# EAGLE design POTENCIOSTATO_22-11-2018 (EAGLE 9.2.2)
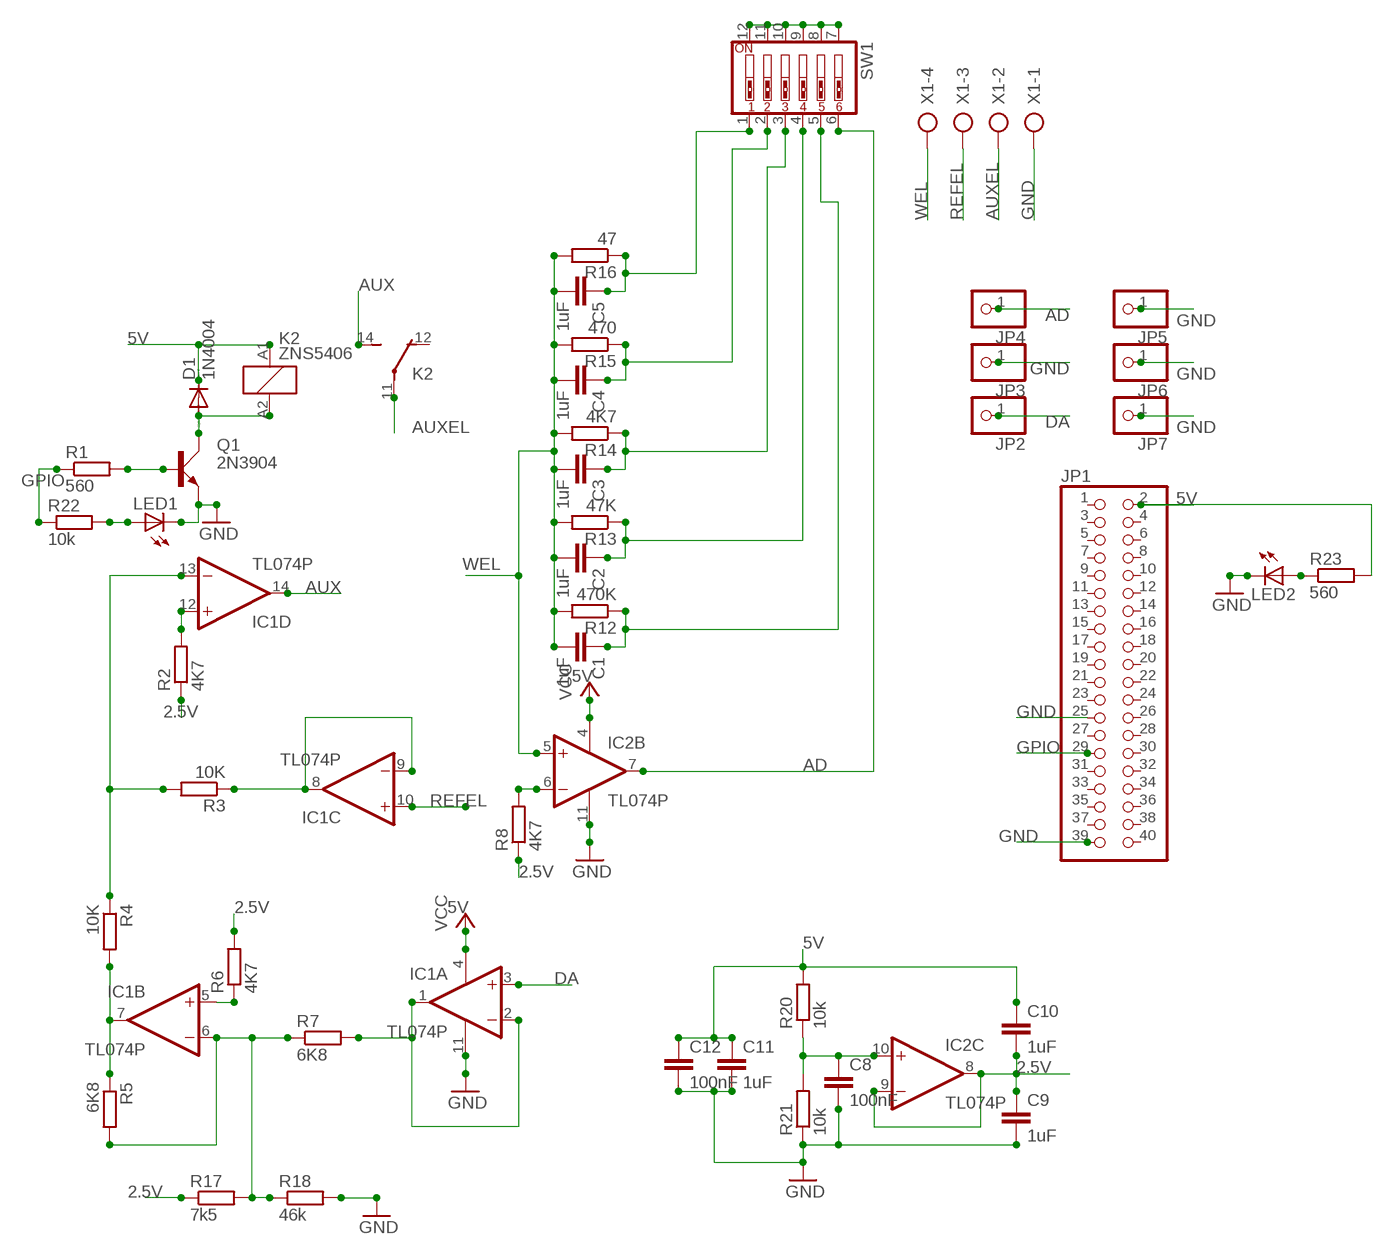
[diagram p0: schematic, sheet 1]

## Parts
C1  1uF  C-EUC0805  [C0805]
C2  1uF  C-EUC0805  [C0805]
C3  1uF  C-EUC0805  [C0805]
C4  1uF  C-EUC0805  [C0805]
C5  1uF  C-EUC0805  [C0805]
C8  100nF  C-EUC0805  [C0805]
C9  1uF  C-EUC0805  [C0805]
C10  1uF  C-EUC0805  [C0805]
C11  1uF  C-EUC0805  [C0805]
C12  100nF  C-EUC0805  [C0805]
D1  1N4004  [DO41-10]
IC1  TL074P  [DIL14]
IC2  TL074P  [DIL14]
JP1  PINHD-2X20/90  [2X20/90]
JP2  PINHD-1X1  [1X01]
JP3  PINHD-1X1  [1X01]
JP4  PINHD-1X1  [1X01]
JP5  PINHD-1X1  [1X01]
JP6  PINHD-1X1  [1X01]
JP7  PINHD-1X1  [1X01]
K2  ZNS5406  [ZN5]
LED1  LEDSML0805  [SML0805]
LED2  LEDSML0805  [SML0805]
Q1  2N3904  [TO92D]
R1  560  R-EU_R0805  [R0805]
R2  4K7  R-EU_R0805  [R0805]
R3  10K  R-EU_R0805  [R0805]
R4  10K  R-EU_R0805  [R0805]
R5  6K8  R-EU_R0805  [R0805]
R6  4K7  R-EU_R0805  [R0805]
R7  6K8  R-EU_R0805  [R0805]
R8  4K7  R-EU_R0805  [R0805]
R12  470K  R-EU_R0805  [R0805]
R13  47K  R-EU_R0805  [R0805]
R14  4K7  R-EU_R0805  [R0805]
R15  470  R-EU_R0805  [R0805]
R16  47  R-EU_R0805  [R0805]
R17  7k5  R-EU_R0805  [R0805]
R18  46k  R-EU_R0805  [R0805]
R20  10k  R-EU_R0805  [R0805]
R21  10k  R-EU_R0805  [R0805]
R22  10k  R-EU_R0805  [R0805]
R23  560  R-EU_R0805  [R0805]
SW1  SW_DIP-6  [EDG-06]
X1  AK500/4  [AK500/4]

## Nets
2.5V: C9.1 C10.2 IC2.8(C:OUT) IC2.9(C:-IN) R2.1 R6.2 R8.1 R17.1
5V: C10.1 C11.1 C12.1 D1.C IC1.4(P:V+) IC2.4(P:V+) JP1.2 K2.A1 R20.2 R23.2 ; supply symbol labelled VCC
AD: IC2.7(B:OUT) JP4.1 SW1.6
AUX: IC1.14(D:OUT) K2.14(2:S)
AUXEL: K2.11(2:P) X1.2
DA: IC1.3(A:+IN) JP2.1
GND: C8.2 C9.2 C11.2 C12.2 IC1.11(P:V-) IC2.11(P:V-) JP1.25 JP1.39 JP3.1 JP5.1 JP6.1 JP7.1 LED1.C LED2.C Q1.E R18.2 R21.1 X1.1
GPIO: JP1.29 R1.1 R22.1
N$1: C5.1 R16.1 SW1.1
N$2: C4.1 R15.1 SW1.2
N$3: C3.1 R14.1 SW1.3
N$4: C2.1 R13.1 SW1.4
N$5: C1.1 R12.1 SW1.5
N$6: IC2.6(B:-IN) R8.2
N$8: SW1.7 SW1.8 SW1.9 SW1.10 SW1.11 SW1.12
N$9: LED1.A R22.2
N$10: C8.1 IC2.10(C:+IN) R20.1 R21.2
N$12: D1.A K2.A2 Q1.C
N$13: IC1.12(D:+IN) R2.2
N$14: Q1.B R1.2
N$15: IC1.8(C:OUT) IC1.9(C:-IN) R3.1
N$16: IC1.13(D:-IN) R3.2 R4.1
N$17: IC1.7(B:OUT) R4.2 R5.1
N$18: IC1.6(B:-IN) R5.2 R7.1 R17.2 R18.1
N$19: IC1.1(A:OUT) IC1.2(A:-IN) R7.2
N$20: IC1.5(B:+IN) R6.1
N$21: LED2.A R23.1
REFEL: IC1.10(C:+IN) X1.3
WEL: C1.2 C2.2 C3.2 C4.2 C5.2 IC2.5(B:+IN) R12.2 R13.2 R14.2 R15.2 R16.2 X1.4
Unconnected: IC2.1(A:OUT) IC2.2(A:-IN) IC2.3(A:+IN) IC2.12(D:+IN) IC2.13(D:-IN) IC2.14(D:OUT) JP1.1 JP1.3 JP1.4 JP1.5 JP1.6 JP1.7 JP1.8 JP1.9 JP1.10 JP1.11 JP1.12 JP1.13 JP1.14 JP1.15 JP1.16 JP1.17 JP1.18 JP1.19 JP1.20 JP1.21 JP1.22 JP1.23 JP1.24 JP1.26 JP1.27 JP1.28 JP1.30 JP1.31 JP1.32 JP1.33 JP1.34 JP1.35 JP1.36 JP1.37 JP1.38 JP1.40 K2.12(2:O)

## Library data of the parts
C1-C5 C8-C12 = resistor:C-EU: CAPACITOR, European symbol
D1 = diode:1N4004: DIODE general purpose rectifier, 1 A
IC1 IC2 = linear:TL074: OP AMP
JP1 = pinhead:PINHD-2X20: PIN HEADER
JP2-JP7 = pinhead:PINHD-1X1: PIN HEADER
K2 = relay:ZNS5*: Miniature Power PCB Relay SCHRACK 1pole 10 A Source: http://www.schrack.com/.. 5847.pdf; OC_FARNELL: unknown; OC_NEWARK: unknown
LED1 LED2 = led:LED: LED OSRAM: - CHIPLED LG R971, LG N971, LY N971, LG Q971, LY Q971, LO R971, LY R971 LH N974, LH R974 LS Q976, LO Q976, LY Q976 LO Q996 - Hyper CHIPLED LW Q18S LB Q993, LB Q99A, LB R99A - SideLED LS A670, LO A670, LY A670, LG A670, LP A670 LB A673, LV A673, LT A673, LW A673 LH A674 LY A675 LS A676, LA A676, LO A676, LY A676, LW A676 LS A679, LY A679, LG A679 - Hyper Micro SIDELED® LS Y876, LA Y876, LO Y876, LY Y876 LT Y87S - SmartLED LW L88C, LW L88S LB L89C, LB L89S, LG L890 LS L89K, LO L89K, LY L89K LS L896, LA L896, LO L896, LY L896 - TOPLED LS T670, LO T670, LY T670, LG T670, LP T670 LSG T670, LSP T670, LSY T670, LOP T670, LYG T670 LG T671, LOG T671, LSG T671 LB T673, LV T673, LT T673, LW T673 LH T674 LS T676, LA T676, LO T676, LY T676, LB T676, LH T676, LSB T676, LW T676 LB T67C, LV T67C, LT T67C, LS T67K, LO T67K, LY T67K, LW E67C LS E67B, LA E67B, LO E67B, LY E67B, LB E67C, LV E67C, LT E67C LW T67C LS T679, LY T679, LG T679 LS T770, LO T770, LY T770, LG T770, LP T770 LB T773, LV T773, LT T773, LW T773 LH T774 LS E675, LA E675, LY E675, LS T675 LS T776, LA T776, LO T776, LY T776, LB T776 LHGB T686 LT T68C, LB T68C - Hyper Mini TOPLED® LB M676 - Mini TOPLED Santana® LG M470 LS M47K, LO M47K, LY M47K Source: http://www.osram.convergy.de LUXEON: - LUMILED® LXK2-PW12-R00, LXK2-PW12-S00, LXK2-PW14-U00, LXK2-PW14-V00 LXK2-PM12-R00, LXK2-PM12-S00, LXK2-PM14-U00 LXK2-PE12-Q00, LXK2-PE12-R00, LXK2-PE12-S00, LXK2-PE14-T00, LXK2-PE14-U00 LXK2-PB12-K00, LXK2-PB12-L00, LXK2-PB12-M00, LXK2-PB14-N00, LXK2-PB14-P00, LXK2-PB14-Q00 LXK2-PR12-L00, LXK2-PR12-M00, LXK2-PR14-Q00, LXK2-PR14-R00 LXK2-PD12-Q00, LXK2-PD12-R00, LXK2-PD12-S00 LXK2-PH12-R00, LXK2-PH12-S00 LXK2-PL12-P00, LXK2-PL12-Q00, LXK2-PL12-R00 Source: www.luxeon.com KINGBRIGHT: KA-3528ASYC Source: www.kingbright.com
Q1 = transistor-small-signal:2N3904: NPN TRANSISTOR
R1-R8 R12-R18 R20-R23 = resistor:R-EU_: RESISTOR, European symbol
SW1 = special:SW_DIP-6: DIP SWITCH
X1 = con-ptr500:AK500/4: CONNECTOR; OC_FARNELL: unknown; OC_NEWARK: unknown

## Board
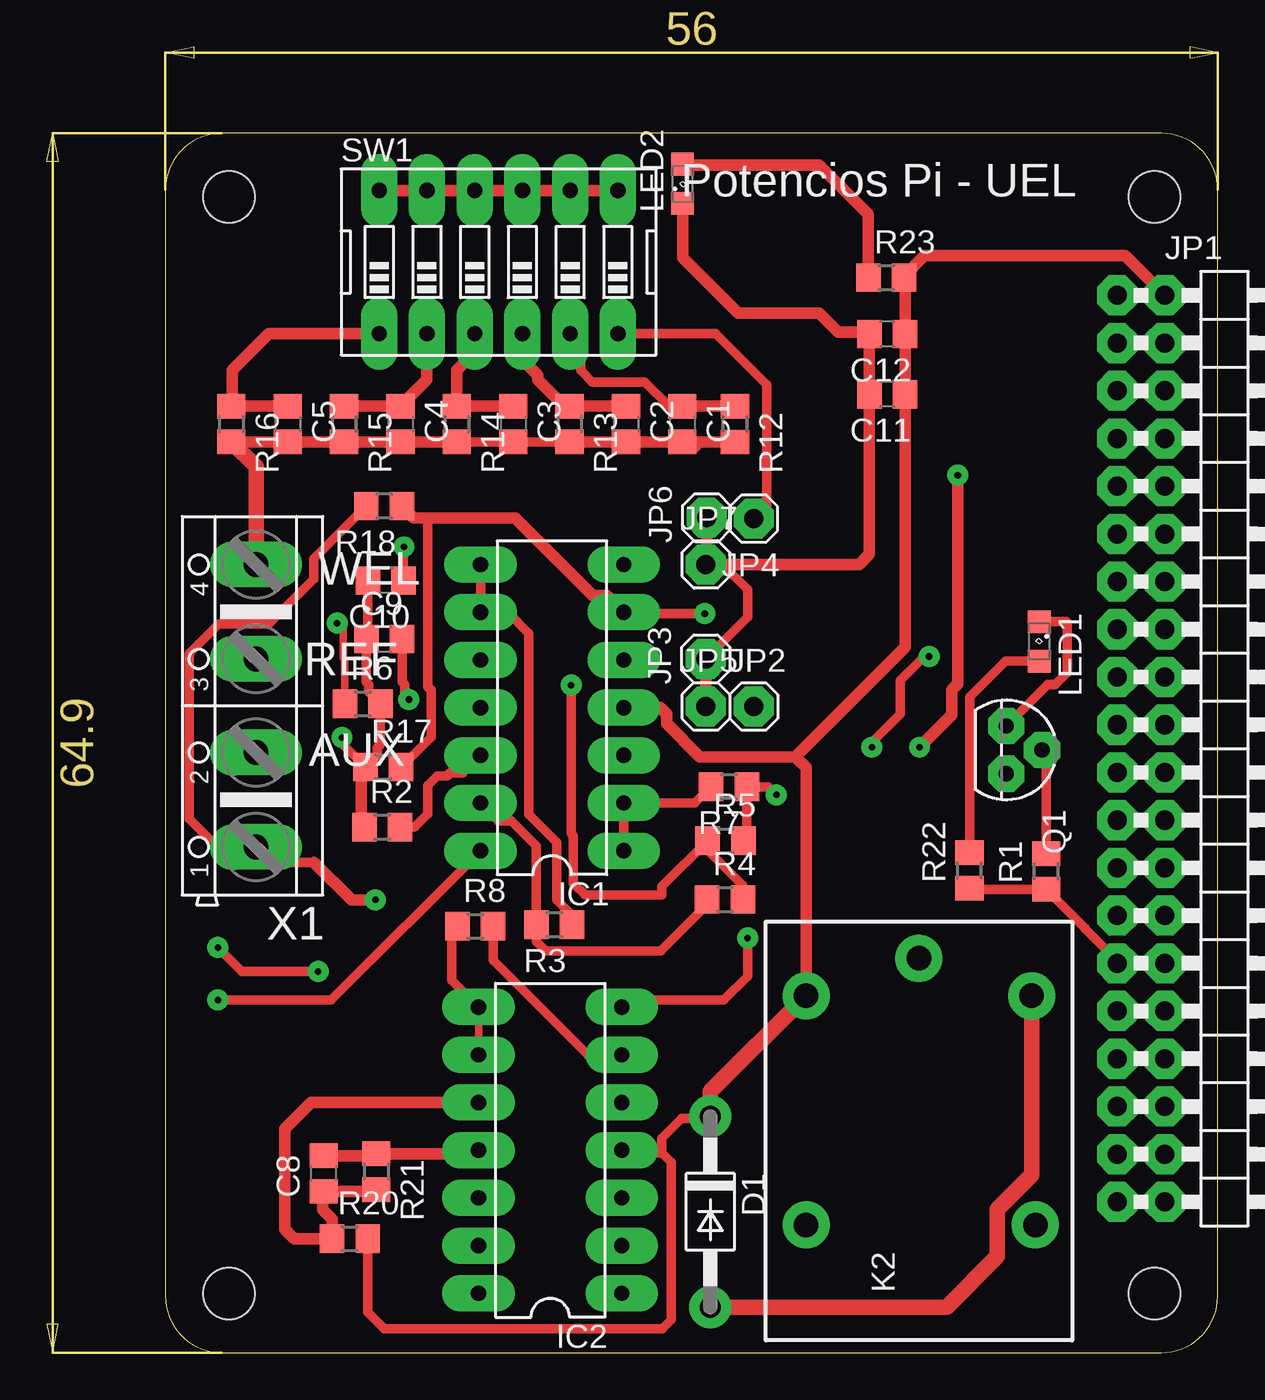
[diagram p1: board, top side]
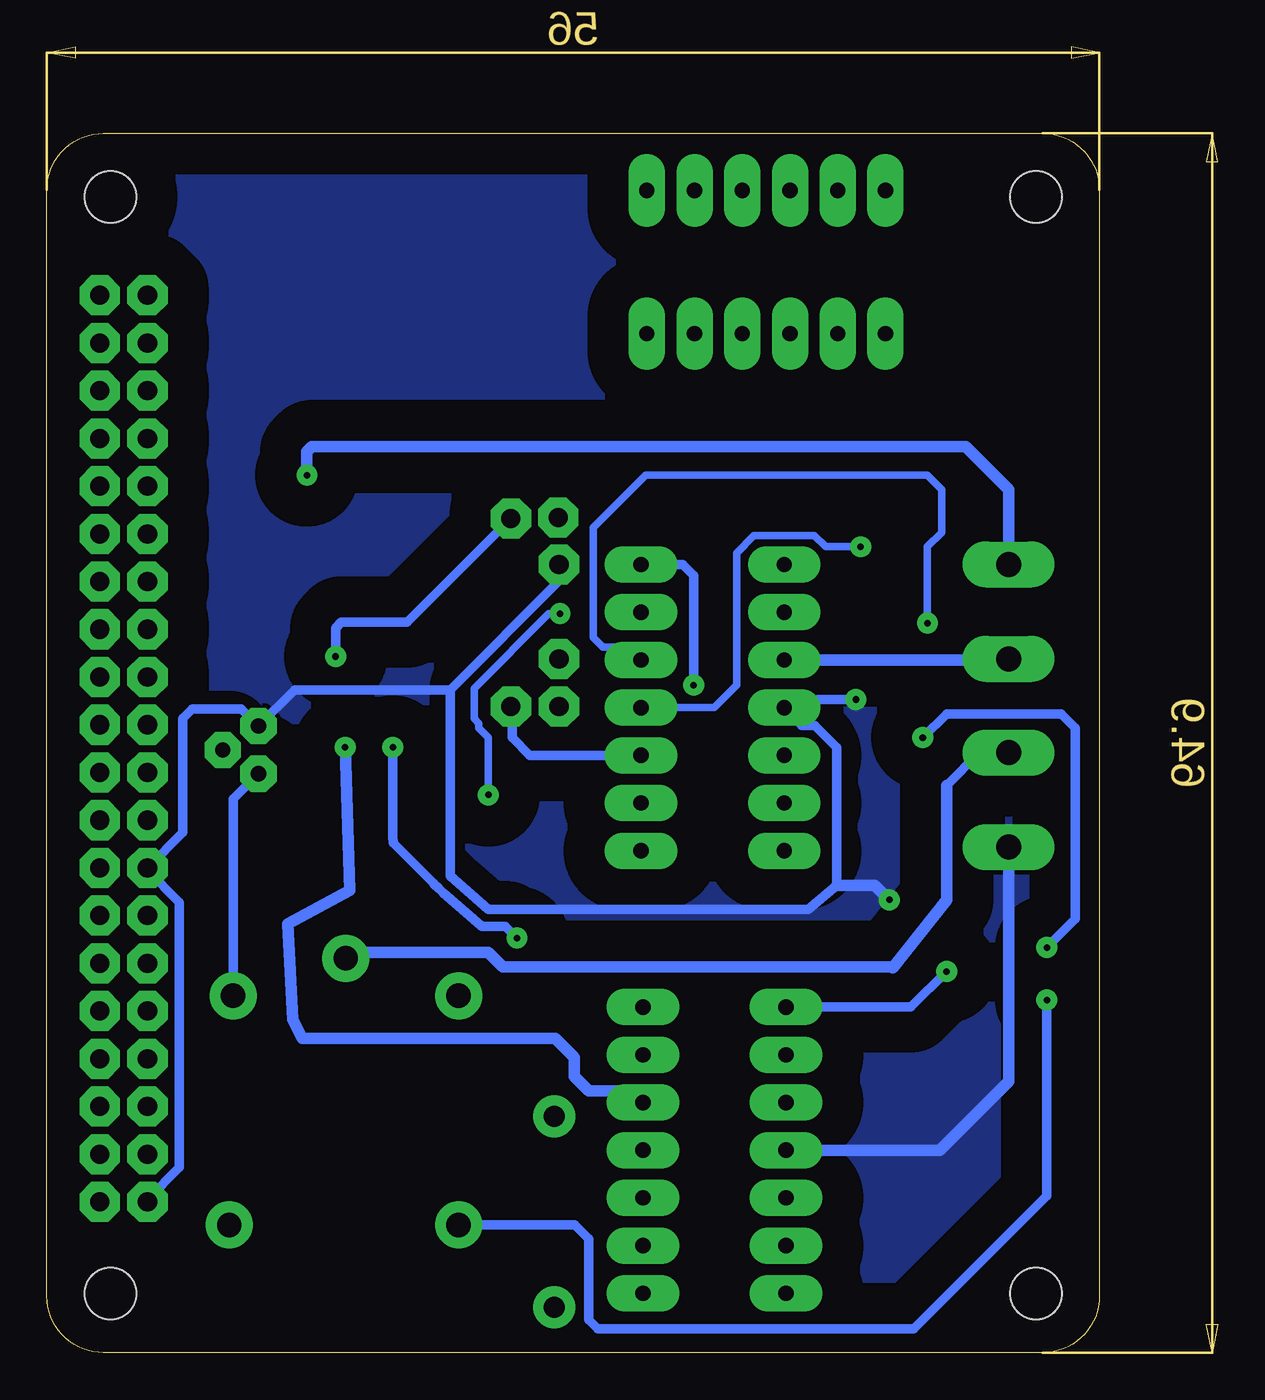
[diagram p2: board, bottom side, seen from below]

Size 56 x 64.9 mm. Coordinates in mm from the lower left corner, seen from the top.
Outline: 0,61.9 0,3 arc90 3,0 53,0 arc90 56,3 56,61.9 arc90 53,64.9 3,64.9 arc90 0,61.9
Copper layers (1*16): Top 0.035mm / dielectric 1.5mm / Bottom 0.035mm
Design rules "default *": minimum track width 12mil, minimum drill 0.35mm, track to track 15mil, track to pad 15mil, pad to pad 10mil, via to via 10mil, smd to smd 10mil, copper to edge 40mil, drill to drill 20mil, minimum pad ring 22mil, minimum via ring 15mil, stop-mask expansion 4mil, vias tented up to drill 0mil, thermal gap 10mil
Holes 2.75 mm at 52.62,61.52 3.38,61.52 3.38,3.15 52.62,3.15

### Footprints (pad centres in the part's own frame; a part is rotated, then mirrored left to right if it is on the bottom)
C0805 = smd 1.3 x 1.5: 1 -0.95,0; 2 0.95,0
DO41-10 = drill 1.118: A 5.08,0; C -5.08,0
DIL14 = drill 0.813 long: 1 -7.62,-3.81; 2 -5.08,-3.81; 3 -2.54,-3.81; 4 0,-3.81; 5 2.54,-3.81; 6 5.08,-3.81; 7 7.62,-3.81; 8 7.62,3.81; 9 5.08,3.81; 10 2.54,3.81; 11 0,3.81; 12 -2.54,3.81; 13 -5.08,3.81; 14 -7.62,3.81
2X20/90 = drill 1.016 octagon: 1 -24.13,-6.35; 2 -24.13,-3.81; 3 -21.59,-6.35; 4 -21.59,-3.81; 5 -19.05,-6.35; 6 -19.05,-3.81; 7 -16.51,-6.35; 8 -16.51,-3.81; 9 -13.97,-6.35; 10 -13.97,-3.81; 11 -11.43,-6.35; 12 -11.43,-3.81; 13 -8.89,-6.35; 14 -8.89,-3.81; 15 -6.35,-6.35; 16 -6.35,-3.81; 17 -3.81,-6.35; 18 -3.81,-3.81; 19 -1.27,-6.35; 20 -1.27,-3.81; 21 1.27,-6.35; 22 1.27,-3.81; 23 3.81,-6.35; 24 3.81,-3.81; 25 6.35,-6.35; 26 6.35,-3.81; 27 8.89,-6.35; 28 8.89,-3.81; 29 11.43,-6.35; 30 11.43,-3.81; 31 13.97,-6.35; 32 13.97,-3.81; 33 16.51,-6.35; 34 16.51,-3.81; 35 19.05,-6.35; 36 19.05,-3.81; 37 21.59,-6.35; 38 21.59,-3.81; 39 24.13,-6.35; 40 24.13,-3.81
1X01 = drill 1.016 octagon: 1 0,0
ZN5 = drill 1.3 pad 2.5: 11 8.89,0; 12 -5.31,-6.2; 14 -5.31,6; A1 6.89,6; A2 6.89,-6
SML0805 = smd 1.2 x 1.2: A 1.05,0; C -1.05,0
TO92D = drill 0.813 octagon: B 0,1.905; C 1.27,0; E -1.27,0
R0805 = smd 1.3 x 1.5: 1 -0.95,0; 2 0.95,0
EDG-06 = drill 0.813 long: 1 -6.35,-3.81; 2 -3.81,-3.81; 3 -1.27,-3.81; 4 1.27,-3.81; 5 3.81,-3.81; 6 6.35,-3.81; 7 6.35,3.81; 8 3.81,3.81; 9 1.27,3.81; 10 -1.27,3.81; 11 -3.81,3.81; 12 -6.35,3.81
AK500/4 = drill 1.321 long: 1 -7.518,0; 2 -2.489,0; 3 2.489,0; 4 7.518,0

### Placement (x,y rotation side)
C1  27.51,49.42 270 top
C2  24.51,49.42 270 top
C3  18.51,49.42 270 top
C4  12.51,49.42 270 top
C5  6.51,49.42 270 top
C8  8.44,9.53 90 top
C9  11.65,37.98 0 top
C10  11.72,41.09 180 top
C11  38.41,51.01 180 top
C12  38.41,54.21 180 top
D1  29,7.5 270 top
IC1  20.58,34.33 90 top
IC2  20.48,10.77 90 top
JP1  57,32.15 270 top
JP2  31.31,34.39 0 top
JP3  28.75,36.93 90 top
JP4  31.31,44.4 180 top
JP5  28.75,34.39 0 top
JP6  28.8,44.45 90 top
JP7  28.75,41.96 0 top
K2  40.1,12.1 90 top
LED1  46.5,37.86 270 top
LED2  27.52,62.21 90 top
Q1  44.75,32.08 270 top
R1  46.87,25.62 90 top
R2  11.54,27.97 0 top
R3  20.69,22.77 180 top
R4  29.78,24.12 0 top
R5  29.81,27.24 0 top
R6  10.5,34.54 0 top
R7  29.99,30.12 180 top
R8  16.5,22.7 0 top
R12  30.31,49.42 270 top
R13  21.51,49.42 270 top
R14  15.51,49.42 270 top
R15  9.51,49.42 270 top
R16  3.51,49.42 270 top
R17  11.6,31.18 0 top
R18  11.64,45.06 180 top
R20  9.82,6.06 0 top
R21  11.23,9.63 270 top
R22  42.79,25.66 90 top
R23  38.36,57.23 0 top
SW1  17.73,58.05 0 top
X1  4.83,34.43 90 top

### Tracks (layer width: path | path; a pad name or v marks a point on that pad's centre or on a via)
2.5V  (via drill 0.35)
  Top 0.406: IC2.8 IC2.9
  Top 0.508: C10.2 10.77,38.05 C9.1 10.7,35.69 10.83,35.55 10.83,35.15 R6.2 11.45,32.37 11.27,32.19 11.27,31.79 R17.1 9.4,32.43 v9.4,32.73 | R8.1 15.24,22.39 15.24,19.82 IC2.8 | v2.79,21.56 4.06,20.29 v8.13,20.29
  Top 0.61: R2.1 10.59,28.49 10.41,28.67 10.41,30.94 R17.1
  Bottom 0.508: v9.4,32.73 8.13,34 2.03,34 1.27,33.24 1.27,23.08 v2.79,21.56 | v8.13,20.29 10.02,18.39 IC2.8
5V  (via drill 0.35)
  Top 0.406: C10.1 12.7,41.12 v12.7,42.89
  Top 0.508: R20.2 10.77,2.15 11.65,1.27 26.45,1.27 26.92,1.74 26.92,10.13 26.42,10.63 | 24.68,10.38 IC2.4 24.43,10.63 26.42,10.63 | D1.C 29,12.46 27.48,12.46 26.42,11.4 26.42,10.63
  Top 0.61: JP1.2 51.08,58.39 40.39,58.39 39.31,57.31 R23.2 39.36,57.18 C12.1 C11.1 39.36,37.55 33.53,31.72 | 33.53,31.72 28.45,31.72 26.67,33.49 26.67,34 26.34,34.33 IC1.4 | 33.53,31.72 34.1,31.14 K2.A1
  Top 0.813: K2.A1 29,13.89 29,12.46
  Bottom 0.406: v12.7,42.89 14.56,42.89 15.16,43.5 18.38,43.5 19.3,42.57 19.3,35.53 20.5,34.33 IC1.4
AD  (via drill 0.35)
  Top 0.508: SW1.6 29.29,54.24 32,51.53 32,45.09 JP4.1 | IC2.7 24.66,18.76 29.72,18.76 30.99,20.03 v30.99,22.06 | v37.59,32.22 37.59,32.48 39.12,34 39.12,35.78 40.39,37.05 v40.64,37.05
  Bottom 0.508: JP4.1 36.83,38.88 40.34,38.88 40.64,38.57 v40.64,37.05 | v30.99,22.06 31.6,22.68 32.85,22.68 32.88,22.7 34.91,24.48 35.15,24.72 35.41,24.94 35.41,24.97 37.57,27.13 37.59,27.47 v37.59,32.22
AUX  (via drill 0.35)
  Top 0.508: v2.79,18.76 8.82,18.76 IC1.14
  Bottom 0.508: K2.14 27.91,6.79 27.18,6.06 27.18,1.74 26.7,1.27 9.87,1.27 2.79,8.35 v2.79,18.76
AUXEL
  Bottom 0.508: 8.13,30.19 6.38,31.94 X1.2
  Bottom 0.61: 8.13,30.19 8.13,24.1 10.98,20.48 11.04,20.54 31.75,20.54 32.51,21.3 39.79,21.3 K2.11
DA
  Bottom 0.508: JP2.1 31.24,34.32 31.24,32.73 30.3,31.79 IC1.3
GND  (via drill 0.35)
  Top 0.508: 16.48,10.58 IC2.11 | R18.2 7.9,42.27 7.9,41.18 5.49,38.77 2.84,38.77 1.75,37.69 1.27,37.2 1.27,28.41 2.77,26.91 X1.1 5.63,26.1 7.9,26.1 | LED1.C 47.93,38.91 48.01,38.83 48.01,36.21 47.37,35.57 46.97,35.57 Q1.E | C9.2 12.6,35.69 12.73,35.55 12.73,34.98 v12.95,34.76 | JP3.1 30.99,39.16 30.99,40.61 29.59,42.01 28.8,42.01
  Top 0.61: LED2.C 27.52,58.3 30.48,55.34 34.8,55.34 35.81,54.32 37.35,54.32 C12.2 C11.2 37.46,42.51 36.91,41.96 JP7.1 28.8,42.01 JP6.1 | JP5.1 JP3.1 | 7.9,26.1 9.91,24.1 v11.18,24.1 | C8.2 11.13,10.48 R21.1 16.48,10.58
  Bottom 0.508: 34.54,35.27 34.54,25.37 32.51,23.59 15.49,23.59 13.97,24.86 13.97,32.22 15.14,33.39 15.83,33.39 IC1.11 16.59,34.51 15.24,34.51 14.99,34.76 v12.95,34.76 | JP7.1 28.75,41.06 34.54,35.27 | 34.54,35.27 42.83,35.27 Q1.E 45.65,34.26 48.26,34.26 48.77,33.75 48.77,27.68 JP1.25 50.65,25.67 48.95,23.96 48.95,9.85 50.65,8.15 JP1.39
  Bottom 0.61: X1.1 4.83,14.44 8.5,10.77 IC2.11 | v11.18,24.1 11.94,24.86 13.97,24.86
  pour Bottom (isolate 2.184): 3.18,65.02 53.18,65.28 arc-90 56.2,62.28 56.2,2.9 arc-90 53.2,-0.1 3.2,-0.1 arc-90 0.2,2.9 0.2,62.02 arc-90
GPIO
  Top 0.508: JP1.29 50.65,20.85 48.95,22.55 48.95,22.59 R1.1 42.84,24.67 R22.1
N$1
  Top 0.61: C5.1 R16.1 3.56,50.42 3.56,52.29 5.51,54.24 SW1.1
N$2
  Top 0.61: R15.1 C4.1 13.92,51.79 SW1.2
N$3
  Top 0.61: C3.1 R14.1 15.51,52.3 16.51,53.31 16.51,54.19 SW1.3
N$4
  Top 0.61: C2.1 R13.1 21.22,50.37 19.81,51.78 19.81,52.04 19.05,52.8 19.05,54.19 SW1.4
N$5
  Top 0.508: SW1.5 22.1,53.68 22.1,52.29 22.73,51.66 25.52,51.66 26.81,50.37 C1.1
  Top 0.61: C1.1 R12.1
N$6
  Top 0.508: R8.2 17.45,20.87 22.47,15.85 IC2.6
N$8
  Top 0.61: SW1.12 SW1.11 SW1.10 SW1.9 SW1.8 SW1.7
N$9
  Top 0.508: R22.2 42.79,34.88 44.71,36.81 LED1.A
N$10
  Top 0.61: IC2.10 7.76,13.31 6.35,11.9 6.35,6.57 6.86,6.06 R20.1 8.87,7.1 8.38,7.59 8.38,8.53 C8.1 11.13,8.58 R21.2
N$12
  Top 0.813: D1.A 41.57,2.42 44.26,5.11 44.26,7.63 46.1,9.47 K2.A2
  Bottom 0.508: K2.A2 46.1,29.46 Q1.C
N$13
  Top 0.508: IC1.12 15.83,30.85 15.14,30.85 14.99,30.7 14.48,30.7 13.97,30.19 13.97,28.67 13.27,27.97 R2.2
N$14
  Top 0.508: R1.2 46.87,31.86 Q1.B
N$15
  Top 0.508: IC1.8 IC1.9 18.21,39.41 19.34,38.29 19.34,28.64 20.83,27.14 20.83,24.1 21.64,23.28 R3.1
N$16
  Top 0.508: IC1.13 17.71,28.31 18.4,28.31 19.74,26.96 R3.2 19.74,21.88 20.23,21.39 26.35,21.39 28.83,23.87 R4.1
N$17  (via drill 0.35)
  Top 0.508: R4.2 30.73,24.86 28.86,26.73 R5.1 26.42,24.8 26.42,24.35 22.35,24.35 21.72,24.98 21.72,27.51 21.59,27.64 v21.59,35.53
  Bottom 0.508: IC1.7 22.17,41.95 21.59,41.37 v21.59,35.53
N$18  (via drill 0.35)
  Top 0.508: R5.2 30.94,27.43 R7.1 32.08,30.12 v32.51,29.68 | 13.97,44.43 13.97,35.43 14.14,35.26 14.14,32.77 R17.2 | IC1.6 24.46,39.34 v28.7,39.34
  Top 0.61: IC1.6 23.5,40.3 22.74,40.3 18.61,44.43 13.97,44.43 13.22,44.43 R18.1
  Bottom 0.406: v32.51,29.68 32.51,32.73 33.02,33.24 33.02,33.49 33.27,33.75 33.27,35.36 29.3,39.34 v28.7,39.34 v28.7,39.33
N$19
  Top 0.508: R7.2 28.18,29.25 IC1.2 IC1.1
N$20  (via drill 0.35)
  Top 0.406: v9.14,38.83 9.46,38.51 9.46,36.98 9.55,36.9 R6.1
  Bottom 0.406: IC1.5 25.08,37.56 26.42,37.56 26.92,38.07 26.92,43.91 24.13,46.7 9.14,46.7 8.38,45.94 8.38,43.65 9.14,42.89 v9.14,38.83
N$21
  Top 0.61: R23.1 37.41,60.6 34.8,63.21 27.57,63.21 LED2.A
REFEL
  Bottom 0.61: IC1.10 4.88,36.87 X1.3
WEL  (via drill 0.35)
  Top 0.508: R14.2 C3.2 R13.2
  Top 0.61: R16.2 C5.2 R15.2 C4.2 R14.2 | R13.2 C2.2 C1.2 | C1.2 27.95,48.47 28.19,48.23 27.76,48.23 C1.2 | C1.2 R12.2 | v40.13,32.22 41.85,33.94 41.85,35.27 42.16,35.59 v42.16,46.7
  Top 0.813: R16.2 4.83,47.16 X1.4
  Bottom 0.61: IC2.5 24.92,13.94 27.18,13.94 27.94,14.7 27.94,15.71 28.96,16.73 42.42,16.73 42.93,17.75 43.18,22.83 39.88,24.6 v40.13,32.22 | X1.4 4.83,45.94 7.11,48.23 41.91,48.23 42.16,47.97 v42.16,46.7

### Text on the board
tNames: Potencios Pi - UEL | WEL | REF | AUX